# Altium schematic sheet Sheet1.SchDoc
size A4
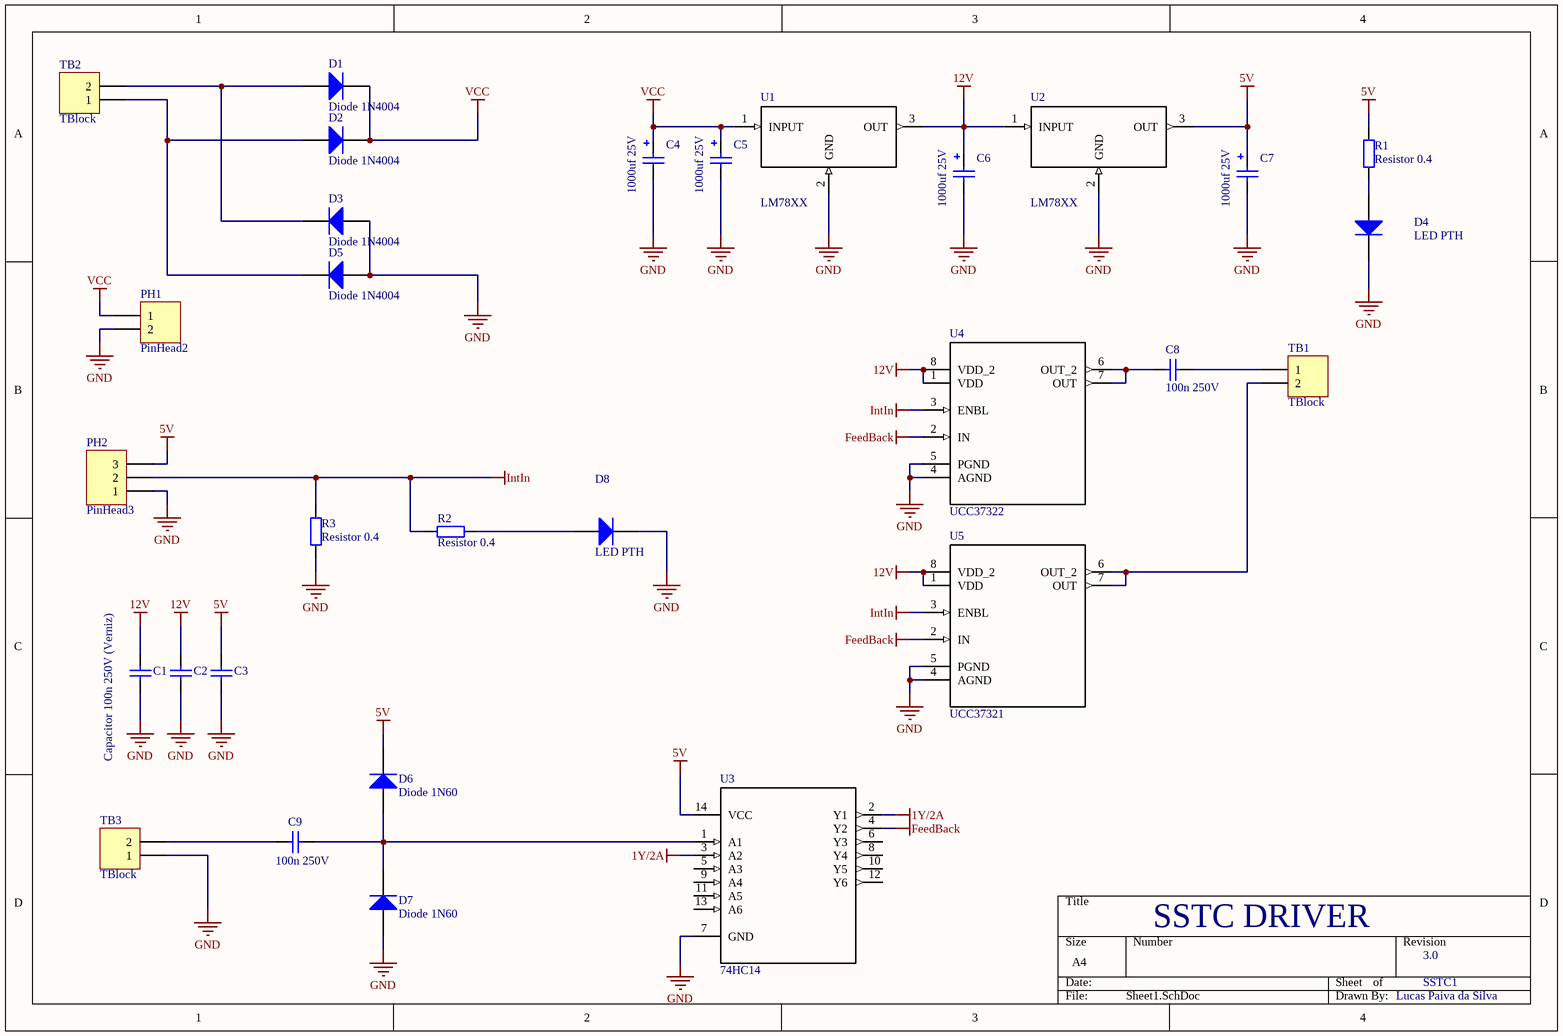
[diagram p0: Sheet1.SchDoc]

## Parts
C1  Capacitor 100n 250V (Verniz)  [Capacitor 100n (cor verniz)]
C2  Capacitor 100n 250V (Verniz)  [Capacitor 100n (cor verniz)]  (value not drawn)
C3  Capacitor 100n 250V (Verniz)  [Capacitor 100n (cor verniz)]  (value not drawn)
C4  1000uf 25V  [Capacitor 1000u 25V]
C5  1000uf 25V  [Capacitor 1000u 25V]
C6  1000uf 25V  [Capacitor 1000u 25V]
C7  1000uf 25V  [Capacitor 1000u 25V]
C8  100n 250V  [Capacitor 100n (cor verniz)]
C9  100n 250V  [Capacitor 100n (cor verniz)]
D1  Diode 1N4004  [Diode 0.4]
D2  Diode 1N4004  [Diode 0.4]
D3  Diode 1N4004  [Diode 0.4]
D4  LED PTH  [LED PTH]
D5  Diode 1N4004  [Diode 0.4]
D6  Diode 1N60  [Diode 0.4]
D7  Diode 1N60  [Diode 0.4]
D8  LED PTH  [LED PTH]
PH1  PinHead2  [PinHead2]
PH2  PinHead3  [PINHEAD3]
R1  Resistor 0.4  [Resistor Axial 0.4]
R2  Resistor 0.4  [Resistor Axial 0.4]
R3  Resistor 0.4  [Resistor Axial 0.4]
TB1  TBlock  [TBlock]
TB2  TBlock  [TBlock]
TB3  TBlock  [TBlock]
U1  LM78XX  [LM317/337]
U2  LM78XX  [LM317/337]
U3  74HC14  [74HC14]
U4  UCC37322  [UCC37322/21]
U5  UCC37321  [UCC37322/21]

## Nets
1Y/2A: U3.2(Y1) U3.3(A2)
5V: C3.2 C7.2 D6.K PH2.3 R1.2 U2.3(OUT) U3.14(VCC)
12V: C1.2 C2.2 C6.2 U1.3(OUT) U2.1(INPUT) U4.1(VDD) U4.8(VDD_2) U5.1(VDD) U5.8(VDD_2)
FeedBack: U3.4(Y2) U4.2(IN) U5.2(IN)
GND: C1.1 C2.1 C3.1 C4.1 C5.1 C6.1 C7.1 D3.A D4.2(K) D5.A D7.A D8.2(K) PH1.2 PH2.1 R3.1 TB3.1 U1.2(GND) U2.2(GND) U3.7(GND) U4.4(AGND) U4.5(PGND) U5.4(AGND) U5.5(PGND)
IntIn: PH2.2 R2.1 R3.2 U4.3(ENBL) U5.3(ENBL)
VCC: C4.2 C5.2 D1.K D2.K PH1.1 U1.1(INPUT)
NetC8_1: C8.1 U4.6(OUT_2) U4.7(OUT)
NetC8_2: C8.2 TB1.1
NetC9_1: C9.1 TB3.2
NetC9_2: C9.2 D6.A D7.K U3.1(A1)
NetD1_A: D1.A D3.K TB2.2
NetD2_A: D2.A D5.K TB2.1
NetD4_1: D4.1(A) R1.1
NetD8_1: D8.1(A) R2.2
NetTB1_2: TB1.2 U5.6(OUT_2) U5.7(OUT)

Not connected (* = marked no-connect by the designer): U3 5(A3) 6(Y3) 8(Y4) 9(A4) 10(Y5) 11(A5) 12(Y6) 13(A6)

## Notes on the sheet
- SSTC DRIVER
- 3.0
- SSTC1
- Lucas Paiva da Silva

## Library data of the parts
C4-C7 = Capacitor 1000uf 25V
C8 C9 = Capacitor 100n 250V (Verniz)
D6 D7 = Diode 1N4004